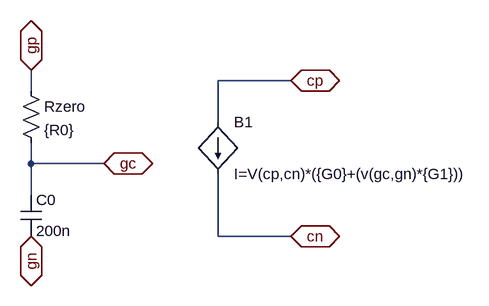
[diagram p0: schematic gazgazgaz.asc]
gazgazgaz.asc, the LTspice schematic file:
Version 4
SHEET 1 880 680
WIRE 352 48 240 48
WIRE -48 64 -48 32
WIRE 240 112 240 48
WIRE -48 176 -48 144
WIRE 64 176 -48 176
WIRE -48 224 -48 176
WIRE 240 288 240 192
WIRE 352 288 240 288
FLAG 352 48 cp
IOPIN 352 48 BiDir
FLAG 352 288 cn
IOPIN 352 288 BiDir
FLAG -48 32 gp
IOPIN -48 32 BiDir
FLAG -48 288 gn
IOPIN -48 288 BiDir
FLAG 64 176 gc
IOPIN 64 176 BiDir
SYMBOL bi 240 112 R0
SYMATTR InstName B1
SYMATTR Value I=V(cp,cn)*({G0}+(v(gc,gn)*{G1}))
SYMBOL res -64 48 R0
SYMATTR InstName Rzero
SYMATTR Value {R0}
SYMBOL cap -64 224 R0
SYMATTR InstName C0
SYMATTR Value 200n

The netlist it stands for:
* gazgazgaz.asc
B1 cp cn I=V(cp,cn)*({G0}+(v(gc,gn)*{G1}))
Rzero gp gc {R0}
C0 gc gn 200n
.backanno
.end